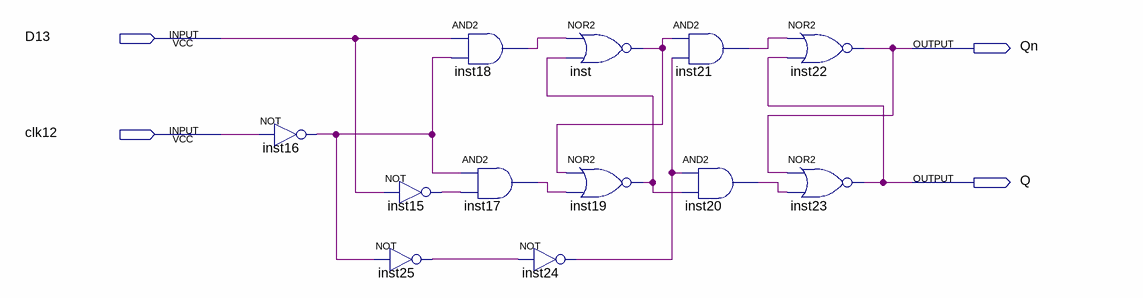
[diagram p0: schematic sheet]
// Quartus schematic ex6_prelab_part2.bdf as structural Verilog: 12 symbols, 4 pins
module ex6_prelab_part2 (
  input  D13,
  input  clk12,
  output Qn,
  output Q
);

  wire inst15_out, inst16_out, inst17_out, inst18_out, inst19_out, inst20_out, inst21_out, inst24_out,
       inst25_out, inst_out;

  not inst16 (inst16_out, clk12);
  not inst15 (inst15_out, D13);
  not inst25 (inst25_out, inst16_out);
  and inst18 (inst18_out, D13, inst16_out);
  and inst17 (inst17_out, inst16_out, inst15_out);
  nor inst (inst_out, inst18_out, inst19_out);
  nor inst19 (inst19_out, inst_out, inst17_out);
  not inst24 (inst24_out, inst25_out);
  and inst21 (inst21_out, inst_out, inst24_out);
  and inst20 (inst20_out, inst24_out, inst19_out);
  nor inst22 (Qn, inst21_out, Q);
  nor inst23 (Q, Qn, inst20_out);
endmodule
